# Altium schematic sheet ersa_schematics_digital.SchDoc: Ersa Module Digital
size A3; Author: Tomash Ghz; CompanyName: GHz Labs; DrawnBy: Tomash Ghz; Engineer: Tomash Ghz; Organization: GHz Labs; Address1: Tomash Ghz; Address2: Berlin 2019; Revision: 1.0; SheetNumber: 1; SheetTotal: 2; DocumentName: Ersa Module Digital; ProjectName: Ersa
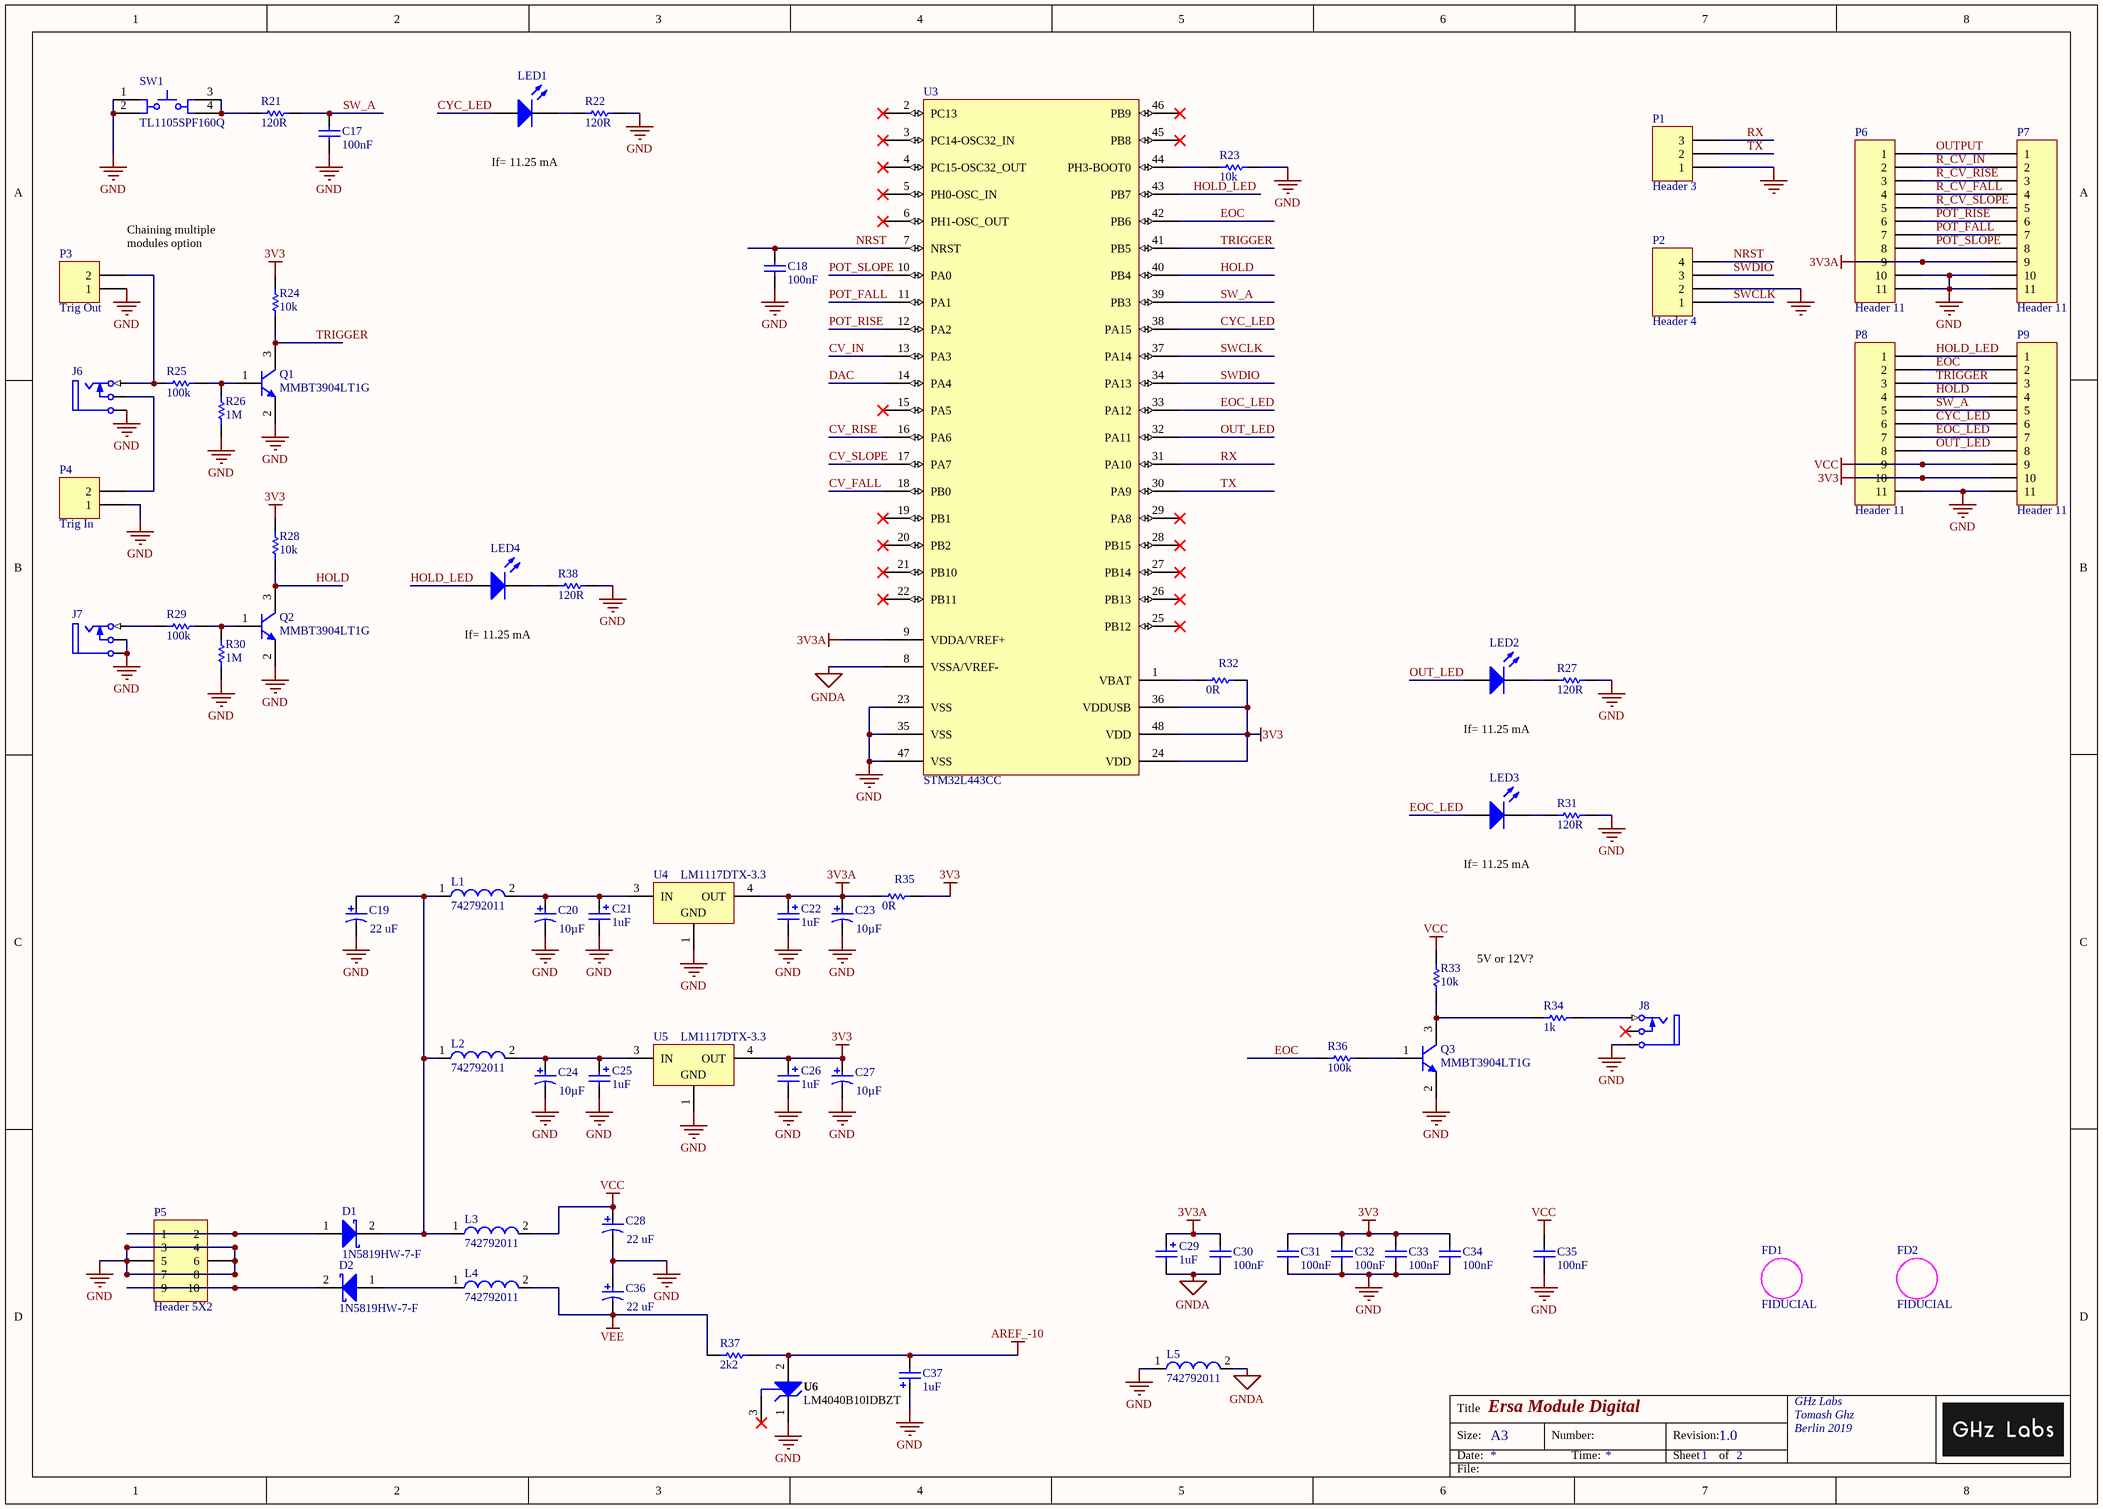
[diagram p0: ersa_schematics_digital.SchDoc]

## Parts
C17  100nF  [CAPA_0805]
C18  100nF  [CAPA_0805]
C19  Rated Capacitance: 22 uF  [NIC-CAPA2-5X5.8_V]  (hidden comment: UUD1C220MCL1GS)
C20  Capacitance: 10µF  [PNSC-FK-V-B_V]  (hidden comment: EEE-FK1V100UR)
C21  1uF  [CAPA_0805 Pol]
C22  1uF  [CAPA_0805 Pol]
C23  Capacitance: 10µF  [PNSC-FK-V-B_V]  (hidden comment: EEE-FK1V100UR)
C24  Capacitance: 10µF  [PNSC-FK-V-B_V]  (hidden comment: EEE-FK1V100UR)
C25  1uF  [CAPA_0805 Pol]
C26  1uF  [CAPA_0805 Pol]
C27  Capacitance: 10µF  [PNSC-FK-V-B_V]  (hidden comment: EEE-FK1V100UR)
C28  Rated Capacitance: 22 uF  [NIC-CAPA2-5X5.8_V]  (hidden comment: UUD1C220MCL1GS)
C29  1uF  [CAPA_0805 Pol]
C30  100nF  [CAPA_0805]
C31  100nF  [CAPA_0805]
C32  100nF  [CAPA_0805]
C33  100nF  [CAPA_0805]
C34  100nF  [CAPA_0805]
C35  100nF  [CAPA_0805]
C36  Rated Capacitance: 22 uF  [NIC-CAPA2-5X5.8_V]  (hidden comment: UUD1C220MCL1GS)
C37  1uF  [CAPA_0805 Pol]
D1  1N5819HW-7-F  [DIOD-SOD-123-2_V]
D2  1N5819HW-7-F  [DIOD-SOD-123-2_V]
FD1  FIDUCIAL  [FIDUCIAL]  (no BOM)
FD2  FIDUCIAL  [FIDUCIAL]  (no BOM)
J6  Phonejack2 TN  [Thonkiconn]  (value not drawn)
J7  Phonejack2 TN  [Thonkiconn]  (value not drawn)
J8  Phonejack2 TN  [Thonkiconn]  (value not drawn)
L1  742792011  [SMD-0805]
L2  742792011  [SMD-0805]
L3  742792011  [SMD-0805]
L4  742792011  [SMD-0805]
L5  742792011  [SMD-0805]
LED1  WP424YDT  [Type 3mm]  (value not drawn)
LED2  WP424YDT  [Type 3mm]  (value not drawn)
LED3  WP424YDT  [Type 3mm]  (value not drawn)
LED4  WP424YDT  [Type 3mm]  (value not drawn)
P1  Header 3  [HDR1X3]
P2  Header 4  [HDR1X4]
P3  Trig Out  [HDR1X2]
P4  Trig In  [HDR1X2]
P5  Header 5X2  [HDR2X5]
P6  Header 11  [HDR1X11]
P7  Header 11  [HDR1X11]
P8  Header 11  [HDR1X11]
P9  Header 11  [HDR1X11]
Q1  MMBT3904LT1G  [ONSC-SOT-23-3-318-08_V]
Q2  MMBT3904LT1G  [ONSC-SOT-23-3-318-08_V]
Q3  MMBT3904LT1G  [ONSC-SOT-23-3-318-08_V]
R21  120R  [RES_0805]
R22  120R  [RES_0805]
R23  10k  [RES_0805]
R24  10k  [RES_0805]
R25  100k  [RES_0805]
R26  1M  [RES_0805]
R27  120R  [RES_0805]
R28  10k  [RES_0805]
R29  100k  [RES_0805]
R30  1M  [RES_0805]
R31  120R  [RES_0805]
R32  0R  [RES_0805]
R33  10k  [RES_0805]
R34  1k  [RES_0805]
R35  0R  [RES_0805]
R36  100k  [RES_0805]
R37  2k2  [RES_0805]
R38  120R  [RES_0805]
SW1  TL1105SPF160Q  [ESWI-TL1105SPF_V]
U3  STM32L443CC  [LQFP48 - STM32L443CC]
U4  LM1117DTX-3.3  [TD03B_M]
U5  LM1117DTX-3.3  [TD03B_M]
U6  LM4040B10IDBZT  [DBZ0003A_M]

## Nets
3V3: C26.1 C27.1 C31.1 C32.1 C33.1 C34.1 P8.10 P9.10 R24.1 R28.1 R32.2 R35.2 U3.24(VDD) U3.36(VDDUSB) U3.48(VDD) U5.4(OUT)
3V3A: C22.1 C23.1 C29.1 C30.1 P6.9 P7.9 R35.1 U3.9(VDDA/VREF+) U4.4(OUT)
AREF_-10: C37.2 R37.1 U6.2(ANODE)
GND: C17.2 C18.2 C19.2 C20.2 C21.2 C22.2 C23.2 C24.2 C25.2 C26.2 C27.2 C28.2 C31.2 C32.2 C33.2 C34.2 C35.2 C36.1 C37.1 J6.5(S) J7.2(TN) J7.5(S) J8.5(S) L5.1 P1.1 P2.2 P3.1 P4.1 P5.3 P5.4 P5.5 P5.6 P5.7 P5.8 P6.10 P6.11 P7.10 P7.11 P8.11 P9.11 Q1.2(E) Q2.2(E) Q3.2(E) R22.1 R23.2 R26.2 R27.1 R30.2 R31.1 R38.1 SW1.1 SW1.2 U3.23(VSS) U3.35(VSS) U3.47(VSS) U4.1(GND) U5.1(GND) U6.1(CATHODE)
GNDA: C29.2 C30.2 L5.2 U3.8(VSSA/VREF-)
VCC: C28.1 C35.1 L3.2 P8.9 P9.9 R33.1
VEE: C36.2 L4.2 R37.2
CV_FALL: U3.18(PB0)
CV_IN: U3.13(PA3)
CV_RISE: U3.16(PA6)
CV_SLOPE: U3.17(PA7)
CYC_LED: LED1.2(A) P8.6 P9.6 U3.38(PA15)
DAC: U3.14(PA4)
EOC: P8.2 P9.2 R36.2 U3.42(PB6)
EOC_LED: LED3.2(A) P8.7 P9.7 U3.33(PA12)
HOLD: P8.4 P9.4 Q2.3(C) R28.2 U3.40(PB4)
HOLD_LED: LED4.2(A) P8.1 P9.1 U3.43(PB7)
NRST: C18.1 P2.4 U3.7(NRST)
OUT_LED: LED2.2(A) P8.8 P9.8 U3.32(PA11)
OUTPUT: P6.1 P7.1
POT_FALL: P6.7 P7.7 U3.11(PA1)
POT_RISE: P6.6 P7.6 U3.12(PA2)
POT_SLOPE: P6.8 P7.8 U3.10(PA0)
R_CV_FALL: P6.4 P7.4
R_CV_IN: P6.2 P7.2
R_CV_RISE: P6.3 P7.3
R_CV_SLOPE: P6.5 P7.5
RX: P1.3 U3.31(PA10)
SW_A: C17.1 P8.5 P9.5 R21.1 U3.39(PB3)
SWCLK: P2.1 U3.37(PA14)
SWDIO: P2.3 U3.34(PA13)
TRIGGER: P8.3 P9.3 Q1.3(C) R24.2 U3.41(PB5)
TX: P1.2 U3.30(PA9)
NetC19_1: C19.1 D1.2(K) L1.1 L2.1 L3.1
NetC20_1: C20.1 C21.1 L1.2 U4.3(IN)
NetC24_1: C24.1 C25.1 L2.2 U5.3(IN)
NetD1_1: D1.1(A) P5.1 P5.2
NetD2_1: D2.1(A) L4.1
NetD2_2: D2.2(K) P5.9 P5.10
NetJ6_1: J6.1(T) P3.2 R25.2
NetJ6_2: J6.2(TN) P4.2
NetJ7_1: J7.1(T) R29.2
NetJ8_1: J8.1(T) R34.1
NetLED1_1: LED1.1(K) R22.2
NetLED2_1: LED2.1(K) R27.2
NetLED3_1: LED3.1(K) R31.2
NetLED4_1: LED4.1(K) R38.2
NetQ1_1: Q1.1(B) R25.1 R26.1
NetQ2_1: Q2.1(B) R29.1 R30.1
NetQ3_1: Q3.1(B) R36.1
NetQ3_3: Q3.3(C) R33.2 R34.2
NetR21_2: R21.2 SW1.3 SW1.4
NetR23_1: R23.1 U3.44(PH3-BOOT0)
NetR32_1: R32.1 U3.1(VBAT)

Not connected (* = marked no-connect by the designer): J8 2(TN)*; U3 2(PC13)* 3(PC14-OSC32_IN)* 4(PC15-OSC32_OUT)* 5(PH0-OSC_IN)* 6(PH1-OSC_OUT)* 15(PA5)* 19(PB1)* 20(PB2)* 21(PB10)* 22(PB11)* 25(PB12)* 26(PB13)* 27(PB14)* 28(PB15)* 29(PA8)* 45(PB8)* 46(PB9)*; U6 3(NC)*

## Notes on the sheet
- If= 11.25 mA
- Chaining multiple modules option
- 5V or 12V?
- Title
- Size:
- Date:
- A3
- Number:
- Time:
- Revision:
- Sheet
- of
- File:

## Library data of the parts
C17 C18 C30-C35 = Cap: Capacitor; Published: 8-Jun-2000; LatestRevisionDate: 17-Jul-2002; LatestRevisionNote: Re-released for DXP Platform.; PackageReference: RAD-0.3; Publisher: Altium Limited; PackageDescription: Radial Cap, Thru-Hole; 2 Leads; 0.3 in Pin Spacing; Value: 100nF
C19 C28 C36 = CMP-0687-00027-1: Aluminum Electrolytic Capacitor, UD Series, Low Impedance, 22 uF, 16 V, + / - 20%, -55 to 105 degC, Chip Type, 5 x 5.8 mm D x L, Pb-Free, Reel; Manufacturer: Nichicon; Tolerance Rated Capacitance: -20 to 20%; Endurance Time: 2000 h; Impedance: 0.76 Ohm; Rated Voltage: 16 V; Rated Ripple Current (at 100kHz): 150 mA; Packing: Dia382mm Reel; PartNumber: UUD1C220MCL1GS; RoHS: TRUE; ComponentLink1URL: http://www.nichicon.co.jp/; PackageReference: CAPAE-D5H5.8; ComponentLink2URL: http://products.nichicon.co.jp/en/pdf/XJA043/e-ud.pdf; ComponentLink3URL: http://products.nichicon.co.jp/en/pdf/XJA043/e-ud.pdf; PackageDescription: 2-Pin Surface Mount Device, Diameter 5 mm, Height 5.8 mm, Pitch 4.4 mm; DatasheetVersion: 08/2012; Mounting Technology: Surface Mount; ComponentLink1Description: Manufacturer URL; Diameter: 5 mm; ComponentLink2Description: Datasheet; Length: 5.8 mm; ComponentLink3Description: Package Specification
C20 C23 C24 C27 = CMP-2000-06211-1: Aluminum Electrolytic Capacitor, 10 uF, +/- 20%, 35 V, 2-Pin SMD (Size Code B), -55 to 105 degC, RoHS, Tape and Reel; Manufacturer: Panasonic; Impedance: 1.35O; Rated Voltage: 35V; Lifetime@Temperature: 2000Hrs@105°C; Ripple Current: 90mA; Type: Can; Manufacturer URL: http://www.panasonic.com/; Package Reference: FK-V-B; Operating Temp Range: -55to+105°C; Series: FK; Datasheet URL: http://industrial.panasonic.com/cdbs/www-data/pdf/RDE0000/ABA0000C1181.pdf; Mounting Technology: SurfaceMount; Package URL: http://industrial.panasonic.com/cdbs/www-data/pdf/RDE0000/DME0000COL48.pdf; Package Description: 2-Pin Electrolytic Aluminum Capacitor, Body 4.3 x 4.3 mm; Datasheet Version: 03/2016; Case Size/Dimension: Ø4x5.8mm; Operating Temp-Max: 105°C
C21 C22 C25 C26 C29 C37 = Cap Pol2: Polarized Capacitor; PartNumber: GRM21BR61C105KA01L; Manufacturer: Murata Electronics; Value: 1uF; Mouser: http://www.mouser.de/ProductDetail/Murata-Electronics/GRM21BR61C105KA01L/?qs=sGAEpiMZZMs0AnBnWHyRQHqtMhGnfkOVy3Os4ZS1iuU%3d
D1 D2 = CMP-0303-00003-1: 1.0 A Surface Mount Schottky Barrier Rectifier, 40 V, -65 to 125 degC, 2-Pin SOD-123 Package, RoHS, Tape and Reel; Manufacturer: Diodes Inc; @ VR (V): 40; @ Terminal Temperature TT (degC): 90; Maximum Average Rectified Current IO (A): 1; Total Capacitance CT (pF): 50; Peak Forward Surge Current IFSM (A): 25; Forward Voltage Drop VF (V): 0.45; VR (RMS) (V): 28; RoHS: TRUE; PartNumber: 1N5819HW-7-F; ComponentLink2URL: http://www.diodes.com/datasheets/ds30217.pdf; PackageDescription: 2-Pin SOD-123, Body 2.7 x 1.55 mm, Pitch 3.7 mm; @ IF (A): 1; Operating and Storage Temperature Range: -65 to 125 degC; ComponentLink1Description: Manufacturer URL; ComponentLink2Description: Datasheet; ComponentLink1URL: http://www.diodes.com/; Mounting Technology: Surface Mount; DatasheetVersion: Rev. 15-2; PackageReference: SOD-123-2; Maximum Reverse Current IR (uA): 50; Peak Repetitive Reverse Voltage VRRM (V): 40; Packing: Tape and Reel
FD1 FD2 = FIDUCIAL_ROUND: Fiducial - Round 1.5 mm Top-Bottom; Manufacturer: No Vendor; PartNumber: FIDUCIAL
J6-J8 = Phonejack2 TN: Jack Socket; Part: ACJM-MV35-2S; Manufacturer: Amphenol Audio; Mouser: http://www.mouser.de/ProductDetail/Amphenol/ACJM-MV35-2S/?qs=%2fha2pyFaduh8uNgKuHZ7oEtHXwcSE0WAH4R1pjDPuhAHZsUXTeJRNg%3d%3d; Datasheet: http://www.amphenolaudio.com/wp-content/uploads/2015/07/55010544-001-rev-2.pdf; Thonk: https://www.thonk.co.uk/shop/3-5mm-jacks/
L1-L5 = CMP-0220-00043-1: SMD EMI Suppression Ferrite Bead WE-CBF, Z = 10 Ohm; Impedance: 10 Ohm; PackageDescription: Chip Inductor, 2-Leads, Body 2.0 x 1.2 mm; PackageReference: SMD-0805; ComponentLink1URL: http://www.we-online.com; PackageVersion: 2005; ComponentLink2Description: Datasheet; ComponentLink2URL: http://www.we-online.de/katalog/media/pdf/742792011.pdf; ComponentLink1Description: Manufacturer Link; DatasheetVersion: Dec-2005
LED1-LED4 = CMP-1488-00001-1: THT LED round mono-color color lens, WL-TMRC, Bright Green; Manufacturer: Kingbright; ComponentLink1URL: http://www.we-online.com; Emitting color: Bright Green; ComponentLink2URL: http://katalog.we-online.de/pbs/datasheet/7448042001.pdfhttp://katalog.we-online.de/pbs/datasheet/7448042001.pdfhttp://katalog.we-online.de/pbs/datasheet/7448042001.pdfhttp://katalog.we-online.de/pbs/datasheet/151031VS04000.pdf; PartNumber: WP424YDT; PackageReference: Type 3mm; ComponentLink2Description: Datasheet; ComponentLink1Description: Manufacturer URL
P1 = Header 3: Header, 3-Pin; LatestRevisionDate: 17-Jul-2002; LatestRevisionNote: Re-released for DXP Platform.; Publisher: Altium Limited
P2 = Header 4: Header, 4-Pin; LatestRevisionDate: 17-Jul-2002; LatestRevisionNote: Re-released for DXP Platform.; Publisher: Altium Limited
P3 P4 = Header 2: Header, 2-Pin; LatestRevisionDate: 17-Jul-2002; LatestRevisionNote: Re-released for DXP Platform.; Publisher: Altium Limited
P5 = Header 5X2: Header, 5-Pin, Dual row; LatestRevisionDate: 17-Jul-2002; LatestRevisionNote: Re-released for DXP Platform.; Publisher: Altium Limited
P6-P9 = Header 11: Header, 11-Pin; LatestRevisionDate: 17-Jul-2002; LatestRevisionNote: Re-released for DXP Platform.; Publisher: Altium Limited
Q1-Q3 = CMP-1048-00631-1: General Purpose Transistor, NPN Silicon, 3-Pin SOT-23, Pb-Free, Tape and Reel; Manufacturer: On Semiconductor; IC Continuous (A): 0.2; fT Min (MHz): 300; ComponentLink2Description: Datasheet; Polarity: NPN; PackageDescription: 3-Pin Small Outline Transistor, Body 2.92 x 1.3 mm, Pitch 0.95 mm; ComponentLink2URL: http://www.onsemi.cn/pub_link/Collateral/MMBT3904LT1-D.PDF; DatasheetVersion: Rev. 12; Mounting Technology: Surface Mount; PartNumber: MMBT3904LT1G; ComponentLink1URL: http://www.onsemi.com/; ComponentLink3Description: Package Specification; ComponentLink1Description: Manufacturer URL; PackageVersion: Rev. AP, 11/2009; PackageReference: SOT-23-3-318-08; Packing: Tape and Reel; ComponentLink3URL: http://www.onsemi.cn/pub_link/Collateral/318-08.PDF; RoHS: TRUE
R21 R22 R27 R31 R38 = Resistor: 120R 0805; PartNumber: RR1220P-105-D; Manufacturer: Susumu; Value: 120R; Mouser: http://www.mouser.de/ProductDetail/Susumu/RR1220P-105-D/?qs=sGAEpiMZZMu61qfTUdNhG%2fDhcyQpRg8MxiYDTLm9lx4%3d
R23 R24 R28 R33 = Resistor: 10k 0805; PartNumber: RR1220P-105-D; Manufacturer: Susumu; Value: 10k; Mouser: http://www.mouser.de/ProductDetail/Susumu/RR1220P-105-D/?qs=sGAEpiMZZMu61qfTUdNhG%2fDhcyQpRg8MxiYDTLm9lx4%3d
R25 R29 R36 = Resistor: 100k 0805; PartNumber: RR1220P-105-D; Manufacturer: Susumu; Value: 100k; Mouser: http://www.mouser.de/ProductDetail/Susumu/RR1220P-105-D/?qs=sGAEpiMZZMu61qfTUdNhG%2fDhcyQpRg8MxiYDTLm9lx4%3d
R26 R30 = Resistor: 1M 0805; PartNumber: RR1220P-105-D; Manufacturer: Susumu; Value: 1M; Mouser: http://www.mouser.de/ProductDetail/Susumu/RR1220P-105-D/?qs=sGAEpiMZZMu61qfTUdNhG%2fDhcyQpRg8MxiYDTLm9lx4%3d
R32 R35 = Resistor: 0R 0805; PartNumber: RR1220P-104-D; Manufacturer: Susumu; Value: 0R; Mouser: http://www.mouser.de/ProductDetail/Susumu/RR1220P-104-D/?qs=sGAEpiMZZMu61qfTUdNhG%2fDhcyQpRg8MUHr%252b%2fl2FgBo%3d
R34 = Resistor: 1k 0805; PartNumber: RR1220P-105-D; Manufacturer: Susumu; Value: 1k; Mouser: http://www.mouser.de/ProductDetail/Susumu/RR1220P-105-D/?qs=sGAEpiMZZMu61qfTUdNhG%2fDhcyQpRg8MxiYDTLm9lx4%3d
R37 = Resistor: 2k2 0805; PartNumber: RR1220P-103-D; Manufacturer: Susumu; Value: 2k2; Mouser: http://www.mouser.de/ProductDetail/Susumu/RR1220P-103-D/?qs=sGAEpiMZZMu61qfTUdNhG%2fDhcyQpRg8MdkVTtHR2gV4%3d
SW1 = CMP-2000-07248-1: Tact Switch, SPST-NO, 50 mA, 12 VDC, -20 to 70 degC, 4-Pin THD, RoHS, Bulk; Manufacturer: E-Switch; Actuation Force: 1.6N; Actuator Style: RoundButton; Package URL: http://spec_sheets.e-switch.com/specs/P010201.pdf; Contact Material: Silver; Size: 6x6mm; Manufacturer URL: http://www.e-switch.ch/en/; Datasheet Version: 12/2013; Package Description: 4-Pin Through Hole Device, Body 6 x 6 mm; Datasheet URL: https://www.e-switch.com/system/asset/product_line/data_sheet/140/TL1105.pdf; Termination Style: RightAngle; Package Reference: TL1105SPF; Mounting Technology: ThroughHole
U3 = STM32L443CC: STM32L443CC - Ultra-low-power Arm® Cortex®-M4 32-bit MCU+FPU, 100DMIPS, 256KB Flash, 64KB RAM; PartNumber: STM32L443CCTx; Manufacturer: STMicroelectronics; Datasheet: https://www.st.com/resource/en/datasheet/stm32l443cc.pdf; Mouser: https://www.mouser.de/ProductDetail/STMicroelectronics/STM32L443CCT6?qs=%2Fha2pyFaduhGuWxD2vAUOIKmdrxmyCPabulFEtM2oEugz2cHqjXy8g%3D%3D
U4 U5 = CMP-0062-00706-2: 800mA Low-Dropout Linear Regulator, 3-pin TO-252; Manufacturer: National Semiconductor; PackageTopMarking: NSUZXYTT*LM1117*DT-3.3; PowerWise: N; CompType: LDO IC; ComponentLink3URL: http://www.national.com/packaging/folders/td03b.html; ComponentLink2URL: http://www.national.com/pf/LM/LM1117.html; ComponentLink2Description: LM1117 Web Page; PinCount: 3; ComponentLink1URL: http://www.national.com/ds/LM/LM1117.pdf; ComponentLink3Description: TD03B Package Page; Code_JEDEC: TO-252-AA; ComponentLink1Description: LM1117 Datasheet; PackageVersion: revD, Feb-2009; RevisionNote: Component URLs added; RoHS: N; DatasheetVersion: Apr-2006; PackageReference: TD03B; PackageDescription: TO252, Molded, Jedec, 6.8 x 6.10 x 2.30mm Body, 3 Lead, 2.28mm Pitch, Surface Mount
U6 = CMP-0366-01043-2: Precision Micropower Shunt Voltage Reference, 0.2% Accuracy, 10 V, 15 ppm / degC, 15 mA, -40 to 85 degC, 3-pin SOT-23 (DBZ), Green (RoHS & no Sb/Br); Manufacturer: Texas Instruments; Temp Coeff(Max)(ppm/ degree C): 100; Rating: Catalog; VO(V): 10; Iout/Iz(Max)(mA): 15; Initial Accuracy @ 25/deg C(%): 0.2; ComponentLink2Description: Datasheet; ComponentLink1URL: http://www.ti.com/; ComponentLink4URL: Samples URL:http://www.ti.com/product/lm4040b10; ComponentLink3Description: Package Specification; PartNumber: LM4040B10IDBZT; DatasheetVersion: SLOS456K; Mounting Technology: Surface Mount; Eco-Plan: Green (RoHS & no Sb/Br); Code_JEDEC: TO-236; SubFamily: Shunt Voltage Reference; PackageDescription: 3-Pin Plastic Small Outline, Body 2.92 x 1.3 mm, Pitch 0.95 mm; ComponentLink2URL: http://www.ti.com/general/docs/lit/getliterature.tsp?genericPartNumber=LM4040B10&fileType=pdf; PackageVersion: 4203227/B; ComponentLink1Description: Manufacturer URL; ComponentLink3URL: http://www.ti.com/litv/pdf/mpds108a; Temp Coeff(Typ)(ppm/ degree C): 15; ComponentLink4Description: URL Link1; Min Iz for Regulation(uA): 100; PackageReference: DBZ0003A